# EAGLE schematic Wheelspeed rev11 (EAGLE 9.6.2)
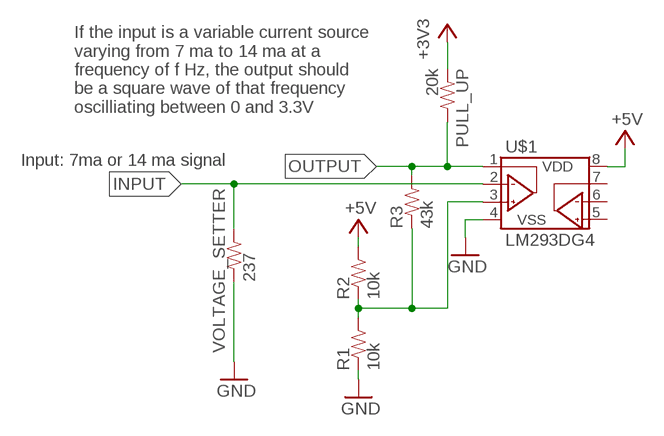
[diagram p0: schematic, sheet 1]

## Parts
PULL_UP  20k  RESISTOR0603  [0603-RES]
R1  10k  RESISTOR0603  [0603-RES]
R2  10k  RESISTOR0603  [0603-RES]
R3  43k  RESISTOR0603  [0603-RES]
U$1  LM293DG4  [SOIC-08]
VOLTAGE_SETTER  237  RESISTOR0603  [0603-RES]

## Nets
+3V3: PULL_UP.1
+5V: R2.2 U$1.8(VDD)
GND: R1.1 U$1.4(VSS) VOLTAGE_SETTER.1
INPUT: U$1.2(VINA-) VOLTAGE_SETTER.2
N$1: R1.2 R2.1 R3.1 U$1.3(VINA+)
OUTPUT: PULL_UP.2 R3.2 U$1.1(VOUTA)
Unconnected: U$1.5(VINB+) U$1.6(VINB-) U$1.7(VOUTB)

## Notes on the sheet
- If the input is a variable current source
  varying from 7 ma to 14 ma at a
  frequency of f Hz, the output should
  be a square wave of that frequency
  oscilliating between 0 and 3.3V
- Input: 7ma or 14 ma signal

## Library data of the parts
PULL_UP R1-R3 VOLTAGE_SETTER = HyTechDevices:RESISTOR: Resistor Basic schematic elements and footprints for 0603, 1206, and PTH resistors.
U$1 = HyTechDevices:LM293: Texas Instruments LM293 Dual Differential Comparator